# Altium project MC1_Board.PrjPcb (part 2 of 2)

## Sheet STM32H573.SchDoc
size A3; SheetNumber: 2; SheetTotal: 8; DocumentSheetName: STM32H573; DocumentAuthor: frtt
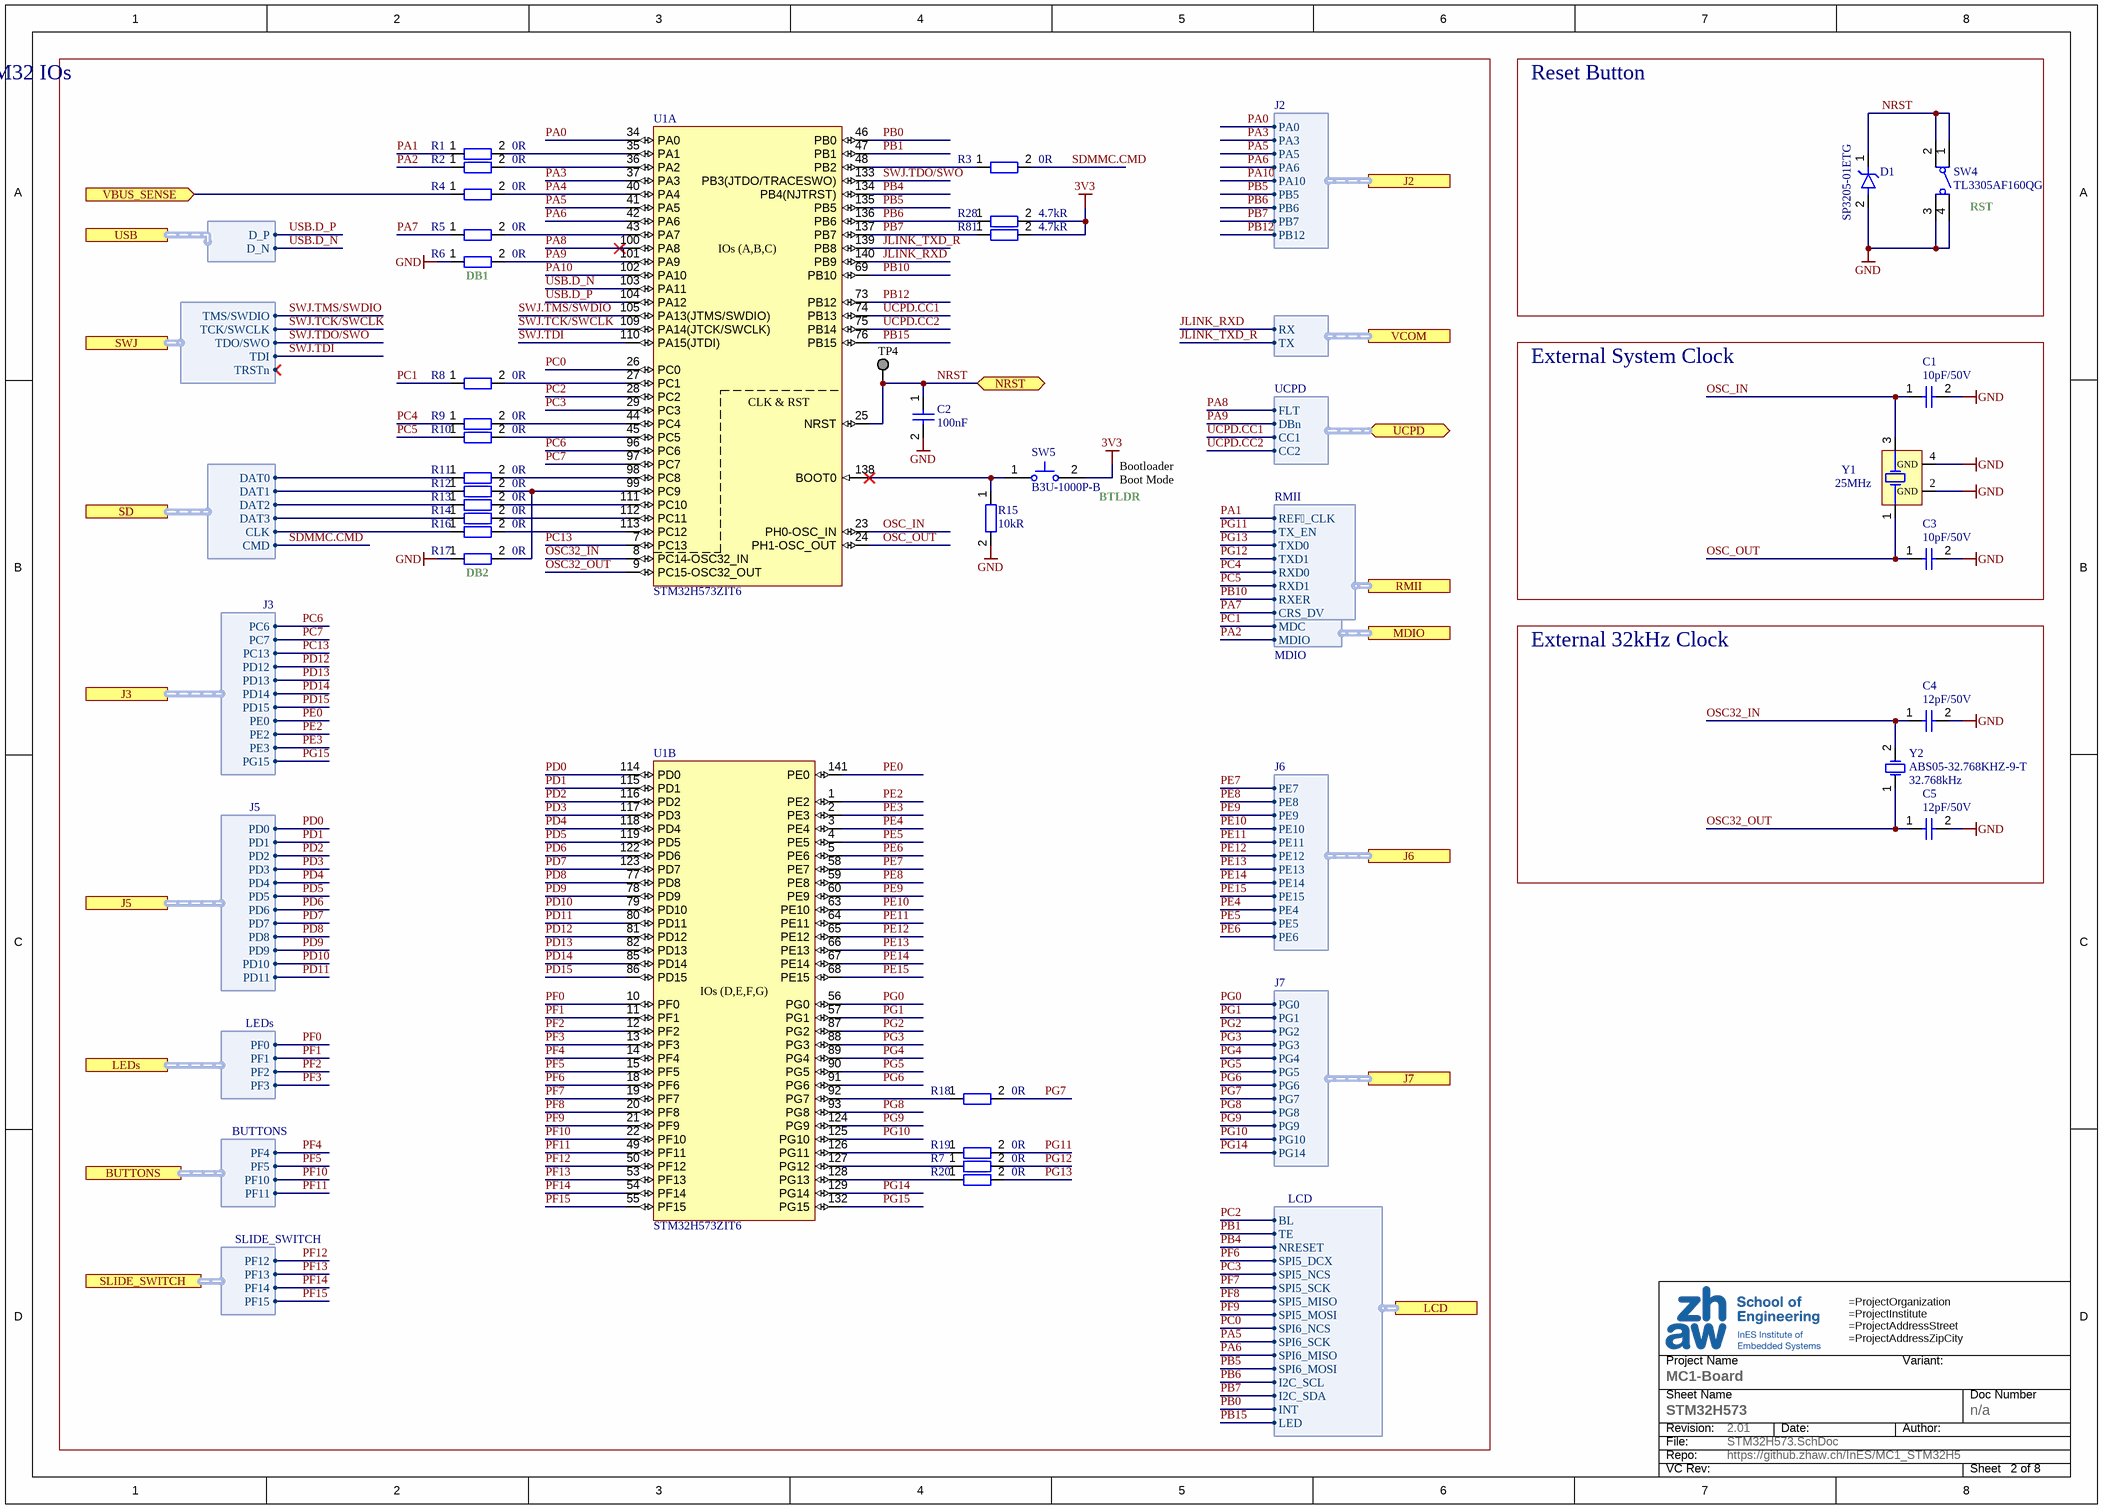
[diagram p7: STM32H573.SchDoc]

### Parts
C1  10pF/50V  [CAPC1005X50N]
C2  value 100nF  [CAPC1005X50N]  (hidden comment: 100nF/16V)
C3  10pF/50V  [CAPC1005X50N]
C4  12pF/50V  [CAPC1005X50N]
C5  12pF/50V  [CAPC1005X50N]
D1  SP3205-01ETG  [DFN65P101X53-2N]
R1  0R  [RESC1005X35N_JUMPER]
R2  0R  [RESC1005X35N_JUMPER]
R3  0R  [RESC1005X35N_JUMPER]
R4  0R  [RESC1005X35N_JUMPER]
R5  0R  [RESC1005X35N_JUMPER]
R6  0R  [RESC1005X35N_JUMPER]
R7  0R  [RESC1005X35N_JUMPER]
R8  0R  [RESC1005X35N_JUMPER]
R9  0R  [RESC1005X35N_JUMPER]
R10  0R  [RESC1005X35N_JUMPER]
R11  0R  [RESC1005X35N_JUMPER]
R12  0R  [RESC1005X35N_JUMPER]
R13  0R  [RESC1005X35N_JUMPER]
R14  0R  [RESC1005X35N_JUMPER]
R15  10kR  [RESC1005X35N]
R16  0R  [RESC1005X35N_JUMPER]
R17  0R  [RESC1005X35N_JUMPER]
R18  0R  [RESC1005X35N_JUMPER]
R19  0R  [RESC1005X35N_JUMPER]
R20  0R  [RESC1005X35N_JUMPER]
R28  4.7kR  [RESC1005X35N]
R81  4.7kR  [RESC1005X35N]
SW4  TL3305AF160QG  [SW_TL3305AF160QG]
SW5  B3U-1000P-B  [SW_B3U-1000P-B]
TP4  5118  [KSTN-5118]  (value not drawn)
U1  STM32H573ZIT6  [LQFP50P2200X2200X160-144N]  (parts A,B of 3)
Y1  Frequency: 25MHz  [OSCCC160X120X45-4]  (hidden comment: ABM12W-25.0000MHZ-8-B1U-T3)
Y2  ABS05-32.768KHZ-9-T  Frequency: 32.768kHz  [OSCCC160X100X50-2L]

### Blocks framed on the sheet
STM32 IOs: C2 R1-R20 R28 R81 SW5 TP4 U1
Reset Button: D1 SW4
External System Clock: C1 C3 Y1
External 32kHz Clock: C4 C5 Y2

### Ports
BUTTONS (harness BUTTONS), J2 (harness J2), J3 (harness J3), J5 (harness J5), J6 (harness J6), J7 (harness J7), LCD (harness LCD), LEDs (harness LEDs), MDIO (harness MDIO), NRST (bidir), RMII (harness RMII), SD (harness SD-Bus), SLIDE_SWITCH (harness SLIDE_SWITCH), SWJ (harness SWJ), UCPD (bidir, harness UCPD), USB (harness USB), VBUS_SENSE (in), VCOM (harness VCOM)

### Harnesses
SD-Bus: DAT0, DAT1, DAT2, DAT3, CLK, CMD
SWJ: TMS/SWDIO, TCK/SWCLK, TDO/SWO, TDI, TRSTn
LCD: SPI5_DCX, SPI5_SCK, SPI5_MISO, SPI5_MOSI, SPI5_NCS, SPI6_NCS, TE, SPI6_SCK, SPI6_MOSI, SPI6_MISO, NRESET, I2C_SCL, I2C_SDA, INT, BL, LED
VCOM: RX, TX
J7: PG0, PG1, PG2, PG3, PG4, PG5, PG6, PG7, PG8, PG9, PG10, PG14
J5: PD0, PD1, PD2, PD3, PD4, PD5, PD6, PD7, PD8, PD9, PD10, PD11
J6: PE7, PE8, PE9, PE10, PE11, PE12, PE13, PE14, PE15, PE4, PE5, PE6
LEDs: PF0, PF1, PF2, PF3
BUTTONS: PF4, PF5, PF10, PF11
SLIDE_SWITCH: PF12, PF13, PF14, PF15
USB: D_P, D_N
RMII: REF_CLK, TX_EN, TXD0, TXD1, RXD0, CRS_DV, RXD1, RXER
UCPD: CC1, CC2, DBn, FLT
J2: PA0, PA3, PA5, PA6, PA10, PB5, PB12, PB6, PB7
J3: PG15, PC6, PC7, PC13, PD12, PD13, PD14, PD15, PE0, PE2, PE3
MDIO: MDC, MDIO

### Nets
3V3: R28.2 R81.2 SW5.2
GND: C1.2 C2.2 C3.2 C4.2 C5.2 D1.2(A) R6.1 R15.2 R17.1 SW4.3 SW4.4 Y1.2(GND) Y1.4(GND)
JLINK_RXD: U1.140(PB9) ; port VCOM.RX
JLINK_TXD_R: U1.139(PB8) ; port VCOM.TX
NRST: C2.1 D1.1(A) SW4.1 SW4.2 TP4.1 U1.25(NRST) ; port NRST
OSC32_IN: C4.1 U1.8(PC14-OSC32_IN) Y2.2
OSC32_OUT: C5.1 U1.9(PC15-OSC32_OUT) Y2.1
OSC_IN: C1.1 U1.23(PH0-OSC_IN) Y1.3(X2)
OSC_OUT: C3.1 U1.24(PH1-OSC_OUT) Y1.1(X1)
PA0: U1.34(PA0) ; port J2.PA0
PA1: R1.1 ; port RMII.REF_CLK  [project net RMII.REF_CLK]
PA2: R2.1 ; port MDIO.MDIO  [project net MDIO.MDIO]
PA3: U1.37(PA3) ; port J2.PA3
PA4: R4.2 U1.40(PA4)
PA5: U1.41(PA5) ; port LCD.SPI6_SCK, port J2.PA5  [project net LCD.SPI6_SCK]
PA6: U1.42(PA6) ; port LCD.SPI6_MISO, port J2.PA6  [project net LCD.SPI6_MISO]
PA7: R5.1 ; port RMII.CRS_DV  [project net RMII.CRS_DV]
PA8: U1.100(PA8) ; port UCPD.FLT  [project net UCPD.FLT]
PA9: R6.2 U1.101(PA9) ; port UCPD.DBn  [project net UCPD.DBn]
PA10: U1.102(PA10) ; port J2.PA10
PB0: U1.46(PB0) ; port LCD.INT  [project net LCD.INT]
PB1: U1.47(PB1) ; port LCD.TE  [project net LCD.TE]
PB4: U1.134(PB4(NJTRST)) ; port LCD.NRESET  [project net LCD.NRESET]
PB5: U1.135(PB5) ; port LCD.SPI6_MOSI, port J2.PB5  [project net LCD.SPI6_MOSI]
PB6: R28.1 U1.136(PB6) ; port LCD.I2C_SCL, port J2.PB6  [project net LCD.I2C_SCL]
PB7: R81.1 U1.137(PB7) ; port LCD.I2C_SDA, port J2.PB7  [project net LCD.I2C_SDA]
PB10: U1.69(PB10) ; port RMII.RXER  [project net RMII.RXER]
PB12: U1.73(PB12) ; port J2.PB12
PB15: U1.76(PB15) ; port LCD.LED  [project net LCD.LED]
PC0: U1.26(PC0) ; port LCD.SPI6_NCS  [project net LCD.SPI6_NCS]
PC1: R8.1 ; port MDIO.MDC  [project net MDIO.MDC]
PC2: U1.28(PC2) ; port LCD.BL  [project net LCD.BL]
PC3: U1.29(PC3) ; port LCD.SPI5_NCS  [project net LCD.SPI5_NCS]
PC4: R9.1 ; port RMII.RXD0  [project net RMII.RXD0]
PC5: R10.1 ; port RMII.RXD1  [project net RMII.RXD1]
PC6: U1.96(PC6) ; port J3.PC6
PC7: U1.97(PC7) ; port J3.PC7
PC13: U1.7(PC13) ; port J3.PC13
PD0: U1.114(PD0) ; port J5.PD0
PD1: U1.115(PD1) ; port J5.PD1
PD2: U1.116(PD2) ; port J5.PD2
PD3: U1.117(PD3) ; port J5.PD3
PD4: U1.118(PD4) ; port J5.PD4
PD5: U1.119(PD5) ; port J5.PD5
PD6: U1.122(PD6) ; port J5.PD6
PD7: U1.123(PD7) ; port J5.PD7
PD8: U1.77(PD8) ; port J5.PD8
PD9: U1.78(PD9) ; port J5.PD9
PD10: U1.79(PD10) ; port J5.PD10
PD11: U1.80(PD11) ; port J5.PD11
PD12: U1.81(PD12) ; port J3.PD12
PD13: U1.82(PD13) ; port J3.PD13
PD14: U1.85(PD14) ; port J3.PD14
PD15: U1.86(PD15) ; port J3.PD15
PE0: U1.141(PE0) ; port J3.PE0
PE2: U1.1(PE2) ; port J3.PE2
PE3: U1.2(PE3) ; port J3.PE3
PE4: U1.3(PE4) ; port J6.PE4
PE5: U1.4(PE5) ; port J6.PE5
PE6: U1.5(PE6) ; port J6.PE6
PE7: U1.58(PE7) ; port J6.PE7
PE8: U1.59(PE8) ; port J6.PE8
PE9: U1.60(PE9) ; port J6.PE9
PE10: U1.63(PE10) ; port J6.PE10
PE11: U1.64(PE11) ; port J6.PE11
PE12: U1.65(PE12) ; port J6.PE12
PE13: U1.66(PE13) ; port J6.PE13
PE14: U1.67(PE14) ; port J6.PE14
PE15: U1.68(PE15) ; port J6.PE15
PF0: U1.10(PF0) ; port LEDs.PF0
PF1: U1.11(PF1) ; port LEDs.PF1
PF2: U1.12(PF2) ; port LEDs.PF2
PF3: U1.13(PF3) ; port LEDs.PF3
PF4: U1.14(PF4) ; port BUTTONS.PF4
PF5: U1.15(PF5) ; port BUTTONS.PF5
PF6: U1.18(PF6) ; port LCD.SPI5_DCX  [project net LCD.SPI5_DCX]
PF7: U1.19(PF7) ; port LCD.SPI5_SCK  [project net LCD.SPI5_SCK]
PF8: U1.20(PF8) ; port LCD.SPI5_MISO  [project net LCD.SPI5_MISO]
PF9: U1.21(PF9) ; port LCD.SPI5_MOSI  [project net LCD.SPI5_MOSI]
PF10: U1.22(PF10) ; port BUTTONS.PF10
PF11: U1.49(PF11) ; port BUTTONS.PF11
PF12: U1.50(PF12) ; port SLIDE_SWITCH.PF12
PF13: U1.53(PF13) ; port SLIDE_SWITCH.PF13
PF14: U1.54(PF14) ; port SLIDE_SWITCH.PF14
PF15: U1.55(PF15) ; port SLIDE_SWITCH.PF15
PG0: U1.56(PG0) ; port J7.PG0
PG1: U1.57(PG1) ; port J7.PG1
PG2: U1.87(PG2) ; port J7.PG2
PG3: U1.88(PG3) ; port J7.PG3
PG4: U1.89(PG4) ; port J7.PG4
PG5: U1.90(PG5) ; port J7.PG5
PG6: U1.91(PG6) ; port J7.PG6
PG7: R18.2 ; port J7.PG7
PG8: U1.93(PG8) ; port J7.PG8
PG9: U1.124(PG9) ; port J7.PG9
PG10: U1.125(PG10) ; port J7.PG10
PG11: R19.2 ; port RMII.TX_EN  [project net RMII.TX_EN]
PG12: R7.2 ; port RMII.TXD1  [project net RMII.TXD1]
PG13: R20.2 ; port RMII.TXD0  [project net RMII.TXD0]
PG14: U1.129(PG14) ; port J7.PG14
PG15: U1.132(PG15) ; port J3.PG15
SDMMC.CLK: R16.1 ; port SD.CLK
SDMMC.CMD: R3.2 ; port SD.CMD
SDMMC.DAT0: R11.1 ; port SD.DAT0
SDMMC.DAT1: R12.1 ; port SD.DAT1
SDMMC.DAT2: R13.1 ; port SD.DAT2
SDMMC.DAT3: R14.1 ; port SD.DAT3
SWJ.TCK/SWCLK: U1.109(PA14(JTCK/SWCLK)) ; port SWJ.TCK/SWCLK
SWJ.TDI: U1.110(PA15(JTDI)) ; port SWJ.TDI
SWJ.TDO/SWO: U1.133(PB3(JTDO/TRACESWO)) ; port SWJ.TDO/SWO
SWJ.TMS/SWDIO: U1.105(PA13(JTMS/SWDIO)) ; port SWJ.TMS/SWDIO
UCPD.CC1: U1.74(PB13) ; port UCPD.CC1
UCPD.CC2: U1.75(PB14) ; port UCPD.CC2
USB.D_N: U1.103(PA11) ; port USB.D_N
USB.D_P: U1.104(PA12) ; port USB.D_P
NetC41_1: R4.1 ; port VBUS_SENSE
NetR1_2: R1.2 U1.35(PA1)
NetR2_2: R2.2 U1.36(PA2)
NetR3_1: R3.1 U1.48(PB2)
NetR5_2: R5.2 U1.43(PA7)
NetR7_1: R7.1 U1.127(PG12)
NetR8_2: R8.2 U1.27(PC1)
NetR9_2: R9.2 U1.44(PC4)
NetR10_2: R10.2 U1.45(PC5)
NetR11_2: R11.2 U1.98(PC8)
NetR12_2: R12.2 R17.2 U1.99(PC9)
NetR13_2: R13.2 U1.111(PC10)
NetR14_2: R14.2 U1.112(PC11)
NetR15_1: R15.1 SW5.1 U1.138(BOOT0)
NetR16_2: R16.2 U1.113(PC12)
NetR18_1: R18.1 U1.92(PG7)
NetR19_1: R19.1 U1.126(PG11)
NetR20_1: R20.1 U1.128(PG13)

### Notes on the sheet
- (near SW4) RST
- (near R6) DB1
- (near SW5) BTLDR
- Bootloader Boot Mode
- (near R17) DB2
- Sheet Name
- Project Name
- Variant:
- Doc Number
- File:
- Repo:
- Revision:
- Date:
- Author:
- VC Rev:
- Sheet
- (in symbol CMP-00715-8, part A) IOs (A,B,C); CLK & RST
- (in symbol CMP-00715-8, part B) IOs (D,E,F,G)

### Library data of the parts
C1 C3 = CMP-001-00011-22: Cap MLCC, 10pF, 50V, C0G, 2.5%, 0402; Case/Package: 0402; Mounting Technology: SMD; Dielectricum: C0G; Voltage Rating: 50V; Case Code (Metric): 1005; Type: MLCC; Value: 10pF; Tolerance: 2.5%
C2 = CMP-001-00001-22: Cap MLCC, 100nF, 16V, X7R, 5%,  0402; Dielectricum: X7R; Type: MLCC; Case Code (Metric): 1005; Voltage Rating: 16V; Case/Package: 0402; Mounting Technology: SMD; Tolerance: 5%
C4 C5 = CMP-001-00072-21: Cap MLCC, 12pF, 50V, C0G, 5%, 0402; Value: 12pF; Case Code (Metric): 1005; Dielectricum: C0G; Tolerance: 5%; Voltage Rating: 50V; Mounting Technology: SMD; Case/Package: 0402; Type: MLCC
D1 = CMP-004-00128-12: TVS Diode, unidirectional, 3.3V, 4A, DFN-1006-2 SOD-882-2; Connection: single; Direction: unidirectional; Mounting Technology: SMD; Rated Voltage: 3.3V; Case/Package: DFN-1006-2 SOD-882-2; Peak Current: 4A; Size: L1.0B0.6H0.5
R1-R14 R16-R20 = CMP-009-00148-34: Res, 0R, 1%, 0.063W, 0402; Value: 0; Power: 63mW; Voltage Rating: 50V; Case/Package: 0402; Tolerance: 1%; Mounting Technology: SMD; Case Code (Metric): 1005; Type: Fixed
R15 = CMP-009-00298-12: Res, 10kR, 1%, 0.063W, 0402; Value: 10k; Power: 63mW; Voltage Rating: 50V; Tolerance: 1%; Type: Fixed; Case Code (Metric): 1005; Case/Package: 0402; Mounting Technology: SMD
R28 R81 = CMP-009-00030-36: Res, 4.7kR, 1%, 0.1W, 0402; Power: 100mW; Voltage Rating: 50V; Value: 4.7k; Type: Fixed; Case/Package: 0402; Tolerance: 1%; Case Code (Metric): 1005; Mounting Technology: SMD
SW4 = CMP-011-00019-14: Push Button, Vertical, SPST-NO, 12V, 50mA, L4.5B7.5H3.5; Illuminated: No; Voltage Rating: 12V; Mounting Technology: SMD; Contact Form: SPST-NO; Current Rating: 50mA; Type: Button; Contact Material: Silver; Size: L4.5B7.5H3.5; Angle: Vertical; Actuation: Push
SW5 = CMP-011-00011-15: Push Button, Vertical, SPST-NO, 12V, 50mA, L2.5B4H1.6; Illuminated: No; Contact Material: Silver; Current Rating: 50mA; Angle: Vertical; Contact Form: SPST-NO; Type: Button; Mounting Technology: SMD; Actuation: Push; Voltage Rating: 12V; Size: L2.5B4H1.6
TP4 = CMP-00075-9: Test Point, Grey, D2.5H4.6, THT, closed ring D1.25; Size: D2.5H4.6; Color: Grey; Mounting Technology: THT
U1 = CMP-00715-8: Microcontroller, STM32, ARM Cortex-M33, 250MHz, Flash 2MB, RAM 640kB, 32bit, LQFP-144; Bit: 32; Min Supply Voltage: 1.71V; Max Supply Voltage: 3.6V; Frequency: 250MHz; Size: L20B20H1.6; Type: Microcontroller; RAM Size: 640kB; Case/Package: LQFP-144; Family: STM32, ARM Cortex-M33; Flash Size: 2MB; Mounting Technology: SMD
Y1 = CMP-00838-4: Crystal Quartz, 25MHz, ±10ppm, 8pF, SMD-4, L1.6B1.2H0.4; ESR: 80; Type: Quartz; Size: L1.6B1.2H0.4; Tolerance: 10ppm; Load Capacitance: 8pF; Case/Package: SMD-4; Mounting Technology: SMD
Y2 = CMP-003-00035-11: Crystal Quartz, 32.768kHz, 20ppm, 9pF, SMD-2; ESR: 90k; Size: L1.6B1.0H0.5; Type: Quartz; Tolerance: 20ppm; Mounting Technology: SMD; Load Capacitance: 9pF; Case/Package: SMD-2

## Nets that join several sheets
3V3: USB (R61.2 R69.1 U8.12), Power (JP1.1 R26.2 R27.1 TP3.1), UI_and_IO-Connectors (20 pins), J-Link-OB (17 pins), Ethernet (8 pins), microSD (7 pins), STM32H573 (R28.2 R81.2 SW5.2)
3V3_MCU: Power (31 pins), J-Link-OB (J13.1)
5V: Power (6 pins), UI_and_IO-Connectors (9 pins)
GND: USB (20 pins), Power (44 pins), UI_and_IO-Connectors (35 pins), J-Link-OB (27 pins), Ethernet (20 pins), microSD (7 pins), STM32H573 (13 pins)
VBUS: USB (6 pins), Power (R23.1 U2.3 U2.5)
VBUS_JLINK: Power (U2.6), J-Link-OB (7 pins)
JLINK_RXD: J-Link-OB (J14.1 U7.39), STM32H573 (U1.140)
JLINK_TXD_R: J-Link-OB (J14.2 R66.2), STM32H573 (U1.139)
LCD.BL: UI_and_IO-Connectors (J4.7), STM32H573 (U1.28)
LCD.I2C_SCL: UI_and_IO-Connectors (J2.7 J4.20), STM32H573 (R28.1 U1.136)
LCD.I2C_SDA: UI_and_IO-Connectors (J2.8 J4.21), STM32H573 (R81.1 U1.137)
LCD.INT: UI_and_IO-Connectors (J4.22), STM32H573 (U1.46)
LCD.LED: UI_and_IO-Connectors (J4.23), STM32H573 (U1.76)
LCD.NRESET: UI_and_IO-Connectors (J4.10), STM32H573 (U1.134)
LCD.SPI5_DCX: UI_and_IO-Connectors (J4.15), STM32H573 (U1.18)
LCD.SPI5_MISO: UI_and_IO-Connectors (J4.12), STM32H573 (U1.20)
LCD.SPI5_MOSI: UI_and_IO-Connectors (J4.13), STM32H573 (U1.21)
LCD.SPI5_NCS: UI_and_IO-Connectors (J4.14), STM32H573 (U1.29)
LCD.SPI5_SCK: UI_and_IO-Connectors (J4.11), STM32H573 (U1.19)
LCD.SPI6_MISO: UI_and_IO-Connectors (J2.4 J4.17), STM32H573 (U1.42)
LCD.SPI6_MOSI: UI_and_IO-Connectors (J2.6 J4.18), STM32H573 (U1.135)
LCD.SPI6_NCS: UI_and_IO-Connectors (J4.19), STM32H573 (U1.26)
LCD.SPI6_SCK: UI_and_IO-Connectors (J2.3 J4.16), STM32H573 (U1.41)
LCD.TE: UI_and_IO-Connectors (J4.9), STM32H573 (U1.47)
MDIO.MDC: Ethernet (U4.13), STM32H573 (R8.1)
MDIO.MDIO: Ethernet (R45.2 U4.12), STM32H573 (R2.1)
NetC41_1: USB (C41.1 R60.2 R62.1), STM32H573 (R4.1)
NRST: J-Link-OB (J13.10 R77.2), Ethernet (U4.15), STM32H573 (6 pins)
PA0: UI_and_IO-Connectors (J2.1), STM32H573 (U1.34)
PA3: UI_and_IO-Connectors (J2.2), STM32H573 (U1.37)
PA10: UI_and_IO-Connectors (J2.5), STM32H573 (U1.102)
PB12: UI_and_IO-Connectors (J2.9), STM32H573 (U1.73)
PC6: UI_and_IO-Connectors (J3.1), STM32H573 (U1.96)
PC7: UI_and_IO-Connectors (J3.2), STM32H573 (U1.97)
PC13: UI_and_IO-Connectors (J3.3), STM32H573 (U1.7)
PD0: UI_and_IO-Connectors (J5.1), STM32H573 (U1.114)
PD1: UI_and_IO-Connectors (J5.2), STM32H573 (U1.115)
PD2: UI_and_IO-Connectors (J5.3), STM32H573 (U1.116)
PD3: UI_and_IO-Connectors (J5.4), STM32H573 (U1.117)
PD4: UI_and_IO-Connectors (J5.5), STM32H573 (U1.118)
PD5: UI_and_IO-Connectors (J5.6), STM32H573 (U1.119)
PD6: UI_and_IO-Connectors (J5.7), STM32H573 (U1.122)
PD7: UI_and_IO-Connectors (J5.8), STM32H573 (U1.123)
PD8: UI_and_IO-Connectors (J5.9), STM32H573 (U1.77)
PD9: UI_and_IO-Connectors (J5.10), STM32H573 (U1.78)
PD10: UI_and_IO-Connectors (J5.11), STM32H573 (U1.79)
PD11: UI_and_IO-Connectors (J5.12), STM32H573 (U1.80)
PD12: UI_and_IO-Connectors (J3.4), STM32H573 (U1.81)
PD13: UI_and_IO-Connectors (J3.5), STM32H573 (U1.82)
PD14: UI_and_IO-Connectors (J3.6), STM32H573 (U1.85)
PD15: UI_and_IO-Connectors (J3.7), STM32H573 (U1.86)
PE0: UI_and_IO-Connectors (J3.8), STM32H573 (U1.141)
PE2: UI_and_IO-Connectors (J3.9), STM32H573 (U1.1)
PE3: UI_and_IO-Connectors (J3.10), STM32H573 (U1.2)
PE4: UI_and_IO-Connectors (J6.10), STM32H573 (U1.3)
PE5: UI_and_IO-Connectors (J6.11), STM32H573 (U1.4)
PE6: UI_and_IO-Connectors (J6.12), STM32H573 (U1.5)
PE7: UI_and_IO-Connectors (J6.1), STM32H573 (U1.58)
PE8: UI_and_IO-Connectors (J6.2), STM32H573 (U1.59)
PE9: UI_and_IO-Connectors (J6.3), STM32H573 (U1.60)
PE10: UI_and_IO-Connectors (J6.4), STM32H573 (U1.63)
PE11: UI_and_IO-Connectors (J6.5), STM32H573 (U1.64)
PE12: UI_and_IO-Connectors (J6.6), STM32H573 (U1.65)
PE13: UI_and_IO-Connectors (J6.7), STM32H573 (U1.66)
PE14: UI_and_IO-Connectors (J6.8), STM32H573 (U1.67)
PE15: UI_and_IO-Connectors (J6.9), STM32H573 (U1.68)
PF0: UI_and_IO-Connectors (LED0.2), STM32H573 (U1.10)
PF1: UI_and_IO-Connectors (LED1.2), STM32H573 (U1.11)
PF2: UI_and_IO-Connectors (LED2.2), STM32H573 (U1.12)
PF3: UI_and_IO-Connectors (LED3.2), STM32H573 (U1.13)
PF4: UI_and_IO-Connectors (R36.1 T0.3 T0.4), STM32H573 (U1.14)
PF5: UI_and_IO-Connectors (R35.1 T1.3 T1.4), STM32H573 (U1.15)
PF10: UI_and_IO-Connectors (R34.1 T2.3 T2.4), STM32H573 (U1.22)
PF11: UI_and_IO-Connectors (R33.1 T3.3 T3.4), STM32H573 (U1.49)
PF12: UI_and_IO-Connectors (SW0.2), STM32H573 (U1.50)
PF13: UI_and_IO-Connectors (SW1.2), STM32H573 (U1.53)
PF14: UI_and_IO-Connectors (SW2.2), STM32H573 (U1.54)
PF15: UI_and_IO-Connectors (SW3.2), STM32H573 (U1.55)
PG0: UI_and_IO-Connectors (J7.1), STM32H573 (U1.56)
PG1: UI_and_IO-Connectors (J7.2), STM32H573 (U1.57)
PG2: UI_and_IO-Connectors (J7.3), STM32H573 (U1.87)
PG3: UI_and_IO-Connectors (J7.4), STM32H573 (U1.88)
PG4: UI_and_IO-Connectors (J7.5), STM32H573 (U1.89)
PG5: UI_and_IO-Connectors (J7.6), STM32H573 (U1.90)
PG6: UI_and_IO-Connectors (J7.7), STM32H573 (U1.91)
PG7: UI_and_IO-Connectors (J7.8), STM32H573 (R18.2)
PG8: UI_and_IO-Connectors (J7.9), STM32H573 (U1.93)
PG9: UI_and_IO-Connectors (J7.10), STM32H573 (U1.124)
PG10: UI_and_IO-Connectors (J7.11), STM32H573 (U1.125)
PG14: UI_and_IO-Connectors (J7.12), STM32H573 (U1.129)
PG15: UI_and_IO-Connectors (J3.11), STM32H573 (U1.132)
RMII.CRS_DV: Ethernet (R54.1), STM32H573 (R5.1)
RMII.REF_CLK: Ethernet (R58.1), STM32H573 (R1.1)
RMII.RXD0: Ethernet (R51.1), STM32H573 (R9.1)
RMII.RXD1: Ethernet (R52.1), STM32H573 (R10.1)
RMII.RXER: Ethernet (R59.2 U4.10), STM32H573 (U1.69)
RMII.TX_EN: Ethernet (U4.16), STM32H573 (R19.2)
RMII.TXD0: Ethernet (U4.17), STM32H573 (R20.2)
RMII.TXD1: Ethernet (U4.18), STM32H573 (R7.2)
SDMMC.CLK: microSD (D3.4 D3.7 J1.5), STM32H573 (R16.1)
SDMMC.CMD: microSD (D3.5 D3.6 J1.3 R37.2), STM32H573 (R3.2)
SDMMC.DAT0: microSD (D3.2 D3.9 J1.7 R38.2), STM32H573 (R11.1)
SDMMC.DAT1: microSD (D3.1 D3.10 J1.8 R39.2), STM32H573 (R12.1)
SDMMC.DAT2: microSD (D4.2 D4.9 J1.1 R40.2), STM32H573 (R13.1)
SDMMC.DAT3: microSD (D4.1 D4.10 J1.2 R41.2), STM32H573 (R14.1)
SWJ.TCK/SWCLK: J-Link-OB (J13.4 R75.2), STM32H573 (U1.109)
SWJ.TDI: J-Link-OB (J13.8 R74.2), STM32H573 (U1.110)
SWJ.TDO/SWO: J-Link-OB (J13.6 R78.2), STM32H573 (U1.133)
SWJ.TMS/SWDIO: J-Link-OB (J13.2 R76.2), STM32H573 (U1.105)
UCPD.CC1: USB (JP2.1), STM32H573 (U1.74)
UCPD.CC2: USB (JP3.1), STM32H573 (U1.75)
UCPD.DBn: USB (U8.10), STM32H573 (R6.2 U1.101)
UCPD.FLT: USB (R69.2 U8.11), STM32H573 (U1.100)
USB.D_N: USB (U5.5), STM32H573 (U1.103)
USB.D_P: USB (U5.6), STM32H573 (U1.104)

## Assembly variants
Final Assembly: not fitted C44 C53 C54 J14 R6 R17 TP4
Default Assembly: not fitted C44 C53 C54 J14 MP1 MP1 R6 R17 TP4